# EAGLE design Led ControllerV2 (EAGLE 9.4.2)
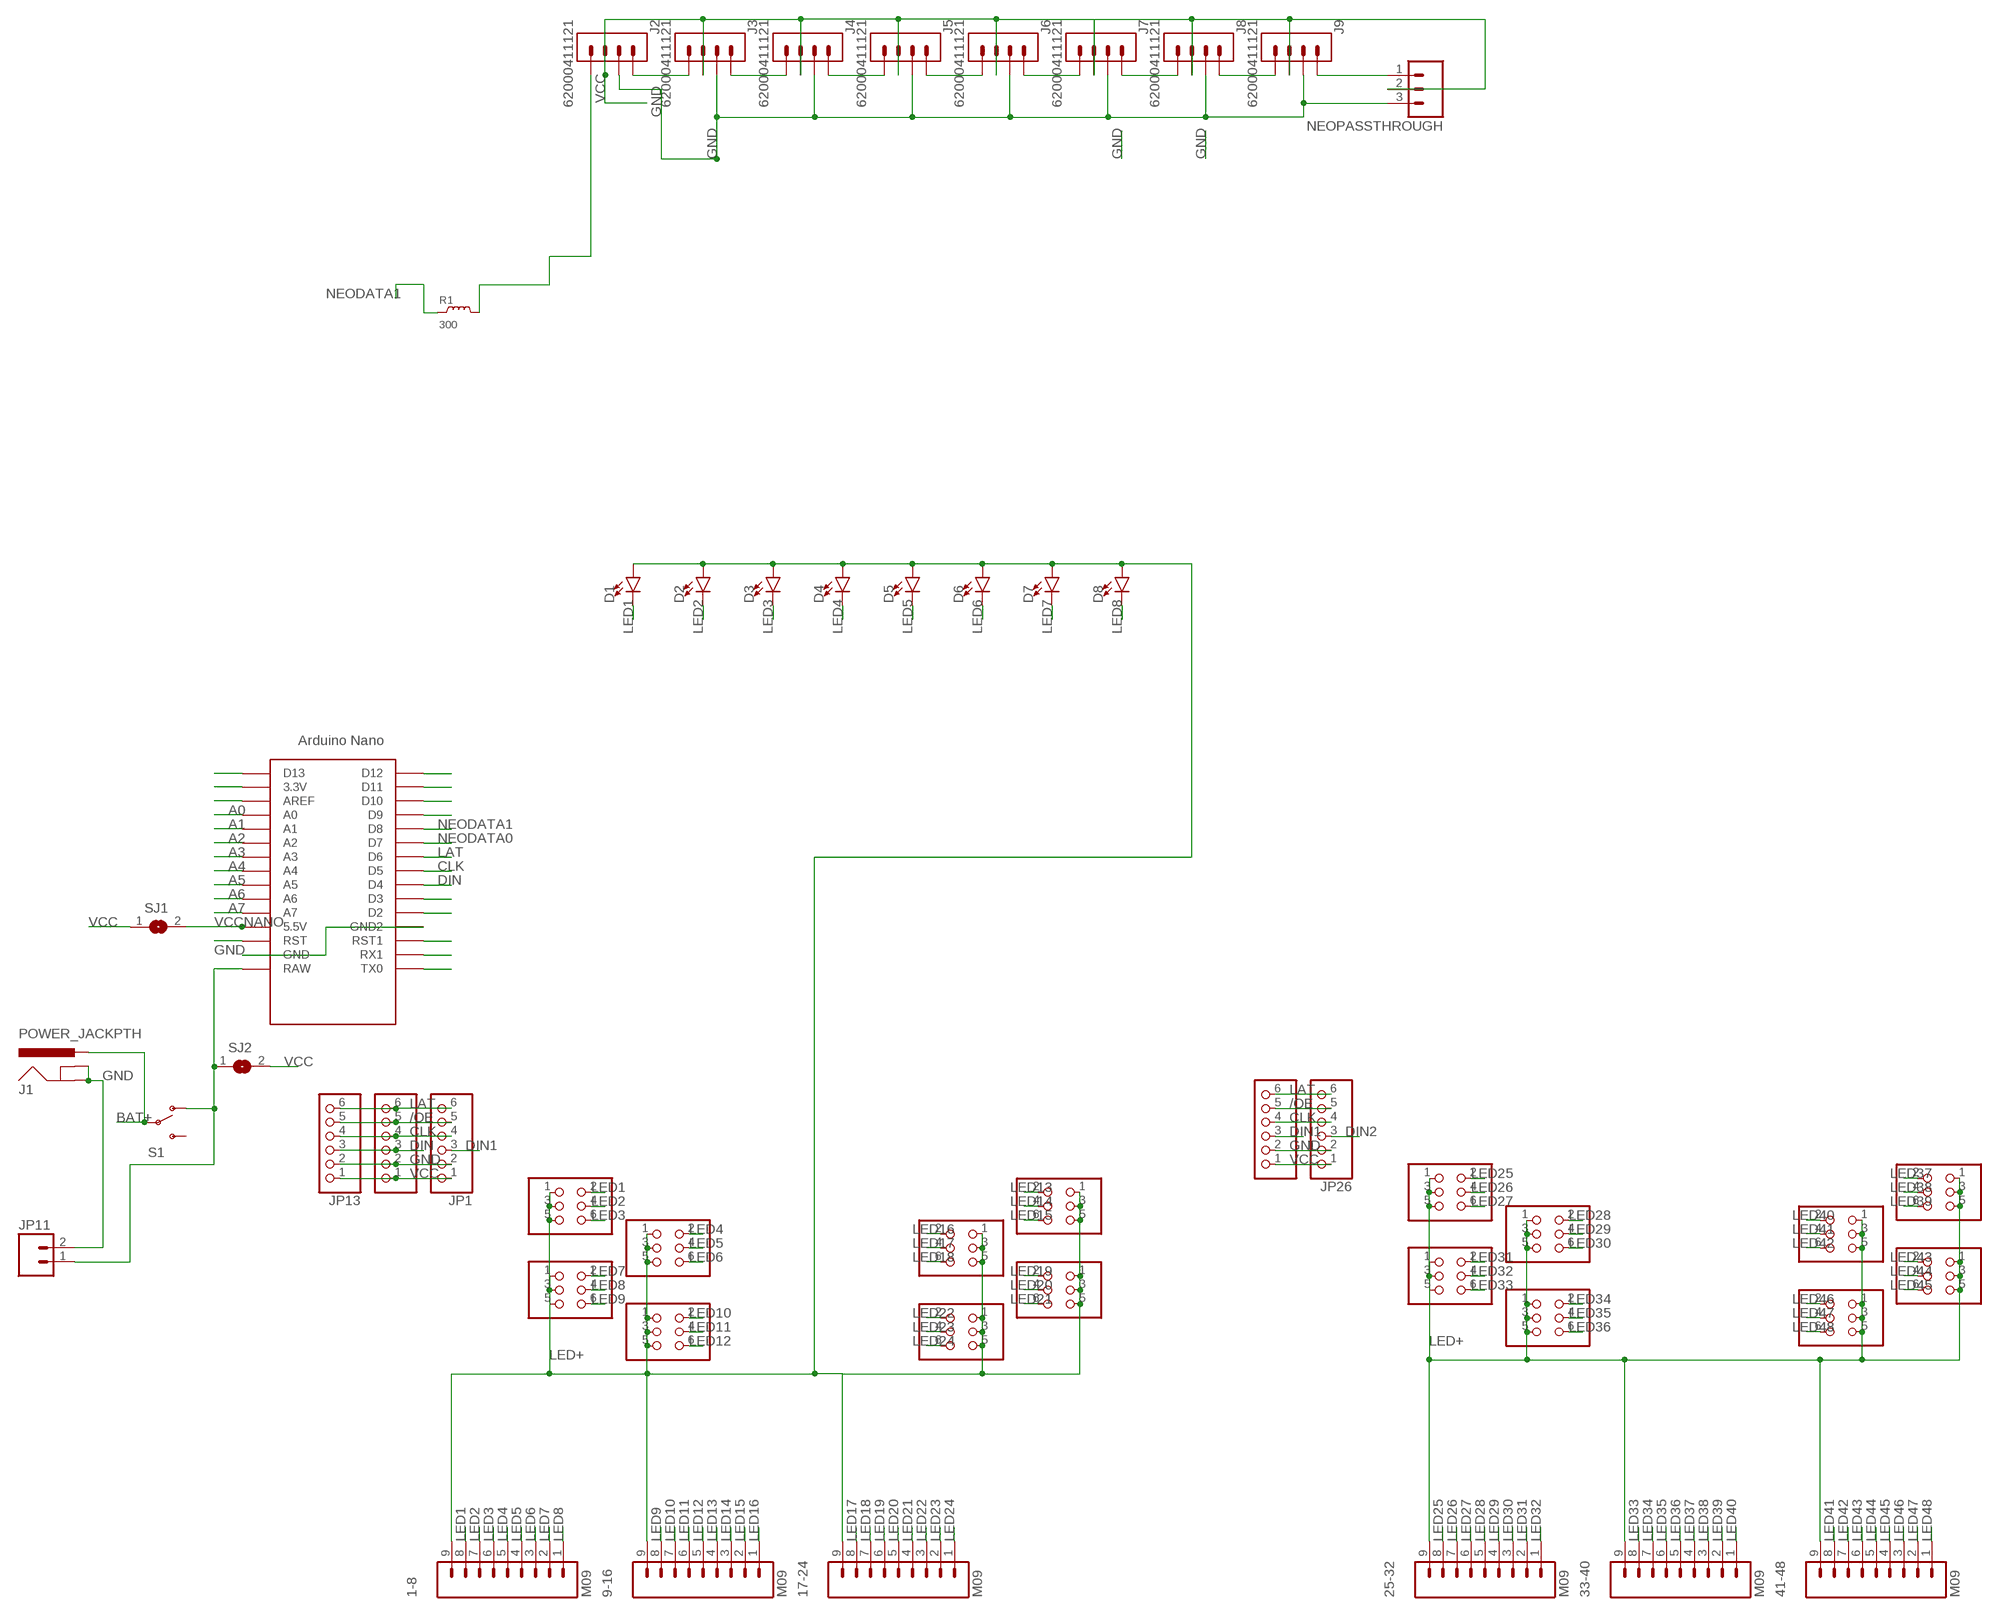
[diagram p0: schematic, sheet 1, part 1 of 2]
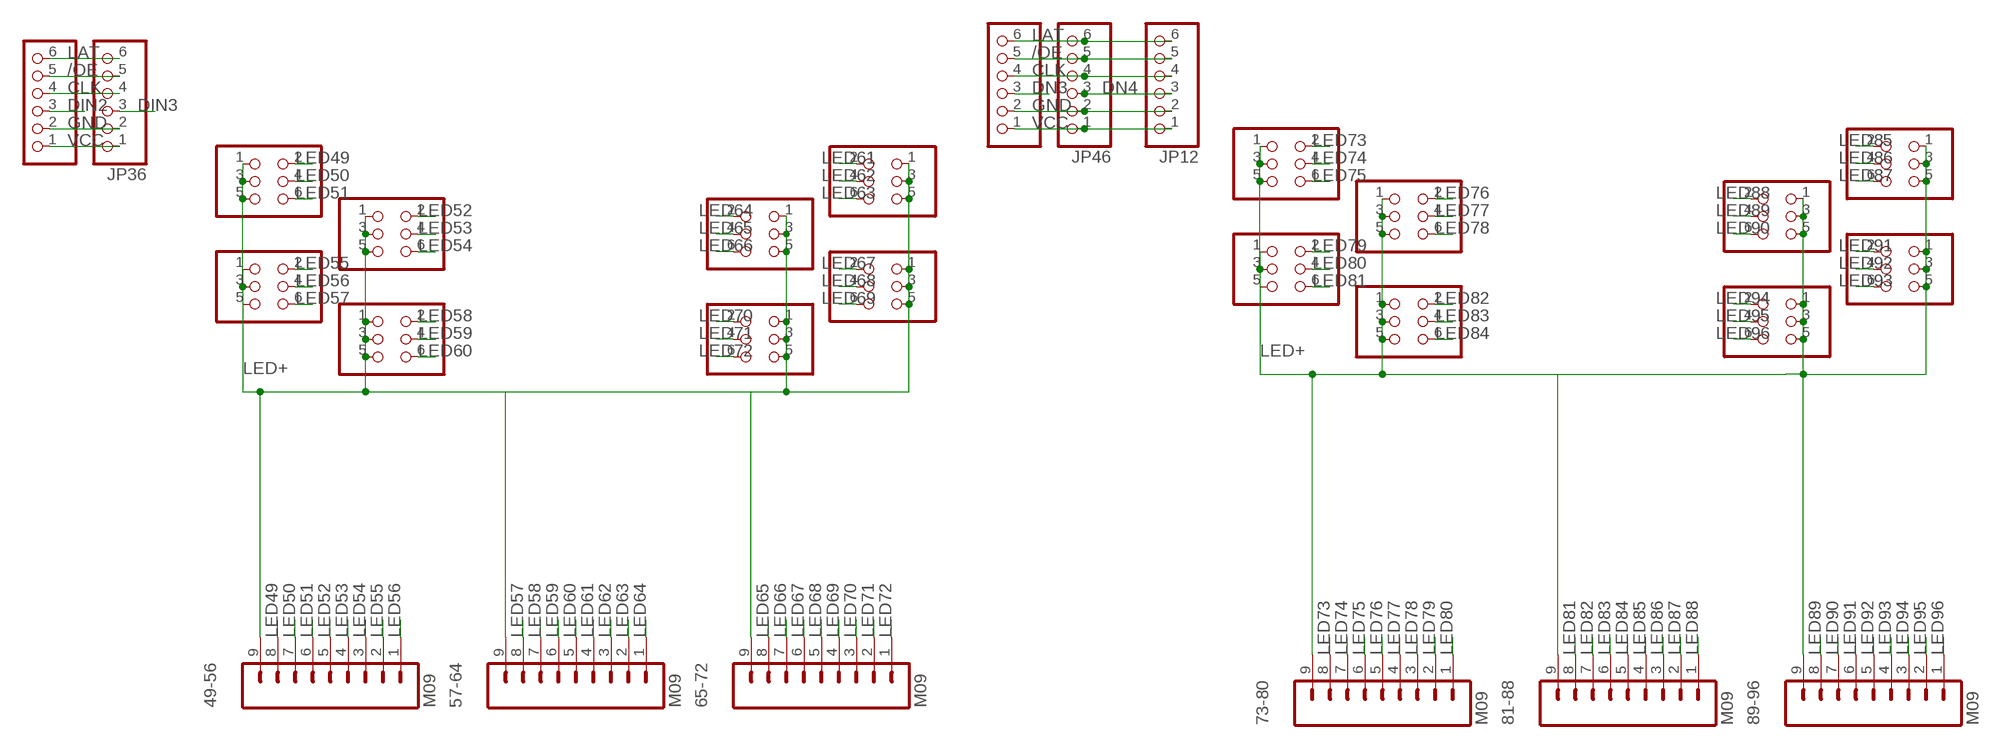
[diagram p1: schematic, sheet 1, part 2 of 2]

## Parts
1-8  M09  [1X09]
9-16  M09  [1X09]
17-24  M09  [1X09]
25-32  M09  [1X09]
33-40  M09  [1X09]
41-48  M09  [1X09]
49-56  M09  [1X09]
57-64  M09  [1X09]
65-72  M09  [1X09]
73-80  M09  [1X09]
81-88  M09  [1X09]
89-96  M09  [1X09]
D1  LED5MM  [LED_5MM]
D2  LED5MM  [LED_5MM]
D3  LED5MM  [LED_5MM]
D4  LED5MM  [LED_5MM]
D5  LED5MM  [LED_5MM]
D6  LED5MM  [LED_5MM]
D7  LED5MM  [LED_5MM]
D8  LED5MM  [LED_5MM]
J1  POWER_JACKPTH  [POWER_JACK_PTH]
J2  62000411121  [62000411121]
J3  62000411121  [62000411121]
J4  62000411121  [62000411121]
J5  62000411121  [62000411121]
J6  62000411121  [62000411121]
J7  62000411121  [62000411121]
J8  62000411121  [62000411121]
J9  62000411121  [62000411121]
JP1  INPUT  PINHD-1X6CB  [1X06-CLEANBIG]
JP2  HEADER-2X3  [2X03_ROUND_70MIL]
JP3  HEADER-2X3  [2X03_ROUND_70MIL]
JP4  HEADER-2X3  [2X03_ROUND_70MIL]
JP5  HEADER-2X3  [2X03_ROUND_70MIL]
JP6  HEADER-2X3  [2X03_ROUND_70MIL]
JP7  HEADER-2X3  [2X03_ROUND_70MIL]
JP8  HEADER-2X3  [2X03_ROUND_70MIL]
JP9  HEADER-2X3  [2X03_ROUND_70MIL]
JP10  OUTPUT  PINHD-1X6CB  [1X06-CLEANBIG]
JP11  M02POLAR  [MOLEX-1X2]
JP12  INPUT  PINHD-1X6CB  [1X06-CLEANBIG]
JP13  INPUT  PINHD-1X6CB  [1X06-CLEANBIG]
JP22  HEADER-2X3  [2X03_ROUND_70MIL]
JP23  HEADER-2X3  [2X03_ROUND_70MIL]
JP24  HEADER-2X3  [2X03_ROUND_70MIL]
JP25  HEADER-2X3  [2X03_ROUND_70MIL]
JP26  INPUT  PINHD-1X6CB  [1X06-CLEANBIG]
JP27  OUTPUT  PINHD-1X6CB  [1X06-CLEANBIG]
JP28  HEADER-2X3  [2X03_ROUND_70MIL]
JP29  HEADER-2X3  [2X03_ROUND_70MIL]
JP30  HEADER-2X3  [2X03_ROUND_70MIL]
JP31  HEADER-2X3  [2X03_ROUND_70MIL]
JP32  HEADER-2X3  [2X03_ROUND_70MIL]
JP33  HEADER-2X3  [2X03_ROUND_70MIL]
JP34  HEADER-2X3  [2X03_ROUND_70MIL]
JP35  HEADER-2X3  [2X03_ROUND_70MIL]
JP36  INPUT  PINHD-1X6CB  [1X06-CLEANBIG]
JP37  OUTPUT  PINHD-1X6CB  [1X06-CLEANBIG]
JP38  HEADER-2X3  [2X03_ROUND_70MIL]
JP39  HEADER-2X3  [2X03_ROUND_70MIL]
JP40  HEADER-2X3  [2X03_ROUND_70MIL]
JP41  HEADER-2X3  [2X03_ROUND_70MIL]
JP42  HEADER-2X3  [2X03_ROUND_70MIL]
JP43  HEADER-2X3  [2X03_ROUND_70MIL]
JP44  HEADER-2X3  [2X03_ROUND_70MIL]
JP45  HEADER-2X3  [2X03_ROUND_70MIL]
JP46  INPUT  PINHD-1X6CB  [1X06-CLEANBIG]
JP47  OUTPUT  PINHD-1X6CB  [1X06-CLEANBIG]
JP48  HEADER-2X3  [2X03_ROUND_70MIL]
JP49  HEADER-2X3  [2X03_ROUND_70MIL]
JP50  HEADER-2X3  [2X03_ROUND_70MIL]
JP51  HEADER-2X3  [2X03_ROUND_70MIL]
NEOPASSTHROUGH  M03PTH  [1X03]
R1  300  COIL-AXL-REGULAR  [AXL-REGULAR]
S1  SWITCH-SPSTPTH  [SWITCH-SPDT]
SJ1  JUMPER  [SJW]
SJ2  JUMPER  [SJW]
U$1  NANO  [NANO]

## Nets
/OE: JP1.5 JP10.5 JP12.5 JP13.5 JP26.5 JP27.5 JP36.5 JP37.5 JP46.5 JP47.5
A0: U$1.A0
A1: U$1.A1
A2: U$1.A2
A3: U$1.A3
A4: U$1.A4
A5: U$1.A5
A6: U$1.A6
A7: U$1.A7
BAT+: J1.PWR S1.2(P)
CLK: JP1.4 JP10.4 JP12.4 JP13.4 JP26.4 JP27.4 JP36.4 JP37.4 JP46.4 JP47.4 U$1.D5
DATAIN: J2.4 R1.2
DIN: JP10.3 JP13.3 U$1.D4
DIN1: JP1.3 JP27.3
DIN2: JP26.3 JP37.3
DIN3: JP36.3
DN3: JP47.3
DN4: JP12.3 JP46.3
GND: J1.GND J1.GNDBREAK J2.2 J3.2 J4.2 J5.2 J6.2 J7.2 J8.2 J9.2 JP1.2 JP10.2 JP11.2 JP12.2 JP13.2 JP26.2 JP27.2 JP36.2 JP37.2 JP46.2 JP47.2 NEOPASSTHROUGH.3 U$1.GND U$1.GND1(GND2)
LAT: JP1.6 JP10.6 JP12.6 JP13.6 JP26.6 JP27.6 JP36.6 JP37.6 JP46.6 JP47.6 U$1.D6
LED1: 1-8.8 D1.K(C) JP2.2
LED2: 1-8.7 D2.K(C) JP2.4
LED3: 1-8.6 D3.K(C) JP2.6
LED4: 1-8.5 D4.K(C) JP3.2
LED5: 1-8.4 D5.K(C) JP3.4
LED6: 1-8.3 D6.K(C) JP3.6
LED7: 1-8.2 D7.K(C) JP4.2
LED8: 1-8.1 D8.K(C) JP4.4
LED9: 9-16.8 JP4.6
LED10: 9-16.7 JP5.2
LED11: 9-16.6 JP5.4
LED12: 9-16.5 JP5.6
LED13: 9-16.4 JP6.2
LED14: 9-16.3 JP6.4
LED15: 9-16.2 JP6.6
LED16: 9-16.1 JP7.2
LED17: 17-24.8 JP7.4
LED18: 17-24.7 JP7.6
LED19: 17-24.6 JP8.2
LED20: 17-24.5 JP8.4
LED21: 17-24.4 JP8.6
LED22: 17-24.3 JP9.2
LED23: 17-24.2 JP9.4
LED24: 17-24.1 JP9.6
LED25: 25-32.8 JP22.2
LED26: 25-32.7 JP22.4
LED27: 25-32.6 JP22.6
LED28: 25-32.5 JP23.2
LED29: 25-32.4 JP23.4
LED30: 25-32.3 JP23.6
LED31: 25-32.2 JP24.2
LED32: 25-32.1 JP24.4
LED33: 33-40.8 JP24.6
LED34: 33-40.7 JP25.2
LED35: 33-40.6 JP25.4
LED36: 33-40.5 JP25.6
LED37: 33-40.4 JP28.2
LED38: 33-40.3 JP28.4
LED39: 33-40.2 JP28.6
LED40: 33-40.1 JP29.2
LED41: 41-48.8 JP29.4
LED42: 41-48.7 JP29.6
LED43: 41-48.6 JP30.2
LED44: 41-48.5 JP30.4
LED45: 41-48.4 JP30.6
LED46: 41-48.3 JP31.2
LED47: 41-48.2 JP31.4
LED48: 41-48.1 JP31.6
LED49: 49-56.8 JP32.2
LED50: 49-56.7 JP32.4
LED51: 49-56.6 JP32.6
LED52: 49-56.5 JP33.2
LED53: 49-56.4 JP33.4
LED54: 49-56.3 JP33.6
LED55: 49-56.2 JP34.2
LED56: 49-56.1 JP34.4
LED57: 57-64.8 JP34.6
LED58: 57-64.7 JP35.2
LED59: 57-64.6 JP35.4
LED60: 57-64.5 JP35.6
LED61: 57-64.4 JP38.2
LED62: 57-64.3 JP38.4
LED63: 57-64.2 JP38.6
LED64: 57-64.1 JP39.2
LED65: 65-72.8 JP39.4
LED66: 65-72.7 JP39.6
LED67: 65-72.6 JP40.2
LED68: 65-72.5 JP40.4
LED69: 65-72.4 JP40.6
LED70: 65-72.3 JP41.2
LED71: 65-72.2 JP41.4
LED72: 65-72.1 JP41.6
LED73: 73-80.8 JP42.2
LED74: 73-80.7 JP42.4
LED75: 73-80.6 JP42.6
LED76: 73-80.5 JP43.2
LED77: 73-80.4 JP43.4
LED78: 73-80.3 JP43.6
LED79: 73-80.2 JP44.2
LED80: 73-80.1 JP44.4
LED81: 81-88.8 JP44.6
LED82: 81-88.7 JP45.2
LED83: 81-88.6 JP45.4
LED84: 81-88.5 JP45.6
LED85: 81-88.4 JP48.2
LED86: 81-88.3 JP48.4
LED87: 81-88.2 JP48.6
LED88: 81-88.1 JP49.2
LED89: 89-96.8 JP49.4
LED90: 89-96.7 JP49.6
LED91: 89-96.6 JP50.2
LED92: 89-96.5 JP50.4
LED93: 89-96.4 JP50.6
LED94: 89-96.3 JP51.2
LED95: 89-96.2 JP51.4
LED96: 89-96.1 JP51.6
LED+: 1-8.9 9-16.9 17-24.9 25-32.9 33-40.9 41-48.9 49-56.9 57-64.9 65-72.9 73-80.9 81-88.9 89-96.9 D1.A D2.A D3.A D4.A D5.A D6.A D7.A D8.A JP2.1 JP2.3 JP2.5 JP3.1 JP3.3 JP3.5 JP4.1 JP4.3 JP4.5 JP5.1 JP5.3 JP5.5 JP6.1 JP6.3 JP6.5 JP7.1 JP7.3 JP7.5 JP8.1 JP8.3 JP8.5 JP9.1 JP9.3 JP9.5 JP22.1 JP22.3 JP22.5 JP23.1 JP23.3 JP23.5 JP24.1 JP24.3 JP24.5 JP25.1 JP25.3 JP25.5 JP28.1 JP28.3 JP28.5 JP29.1 JP29.3 JP29.5 JP30.1 JP30.3 JP30.5 JP31.1 JP31.3 JP31.5 JP32.1 JP32.3 JP32.5 JP33.1 JP33.3 JP33.5 JP34.1 JP34.3 JP34.5 JP35.1 JP35.3 JP35.5 JP38.1 JP38.3 JP38.5 JP39.1 JP39.3 JP39.5 JP40.1 JP40.3 JP40.5 JP41.1 JP41.3 JP41.5 JP42.1 JP42.3 JP42.5 JP43.1 JP43.3 JP43.5 JP44.1 JP44.3 JP44.5 JP45.1 JP45.3 JP45.5 JP48.1 JP48.3 JP48.5 JP49.1 JP49.3 JP49.5 JP50.1 JP50.3 JP50.5 JP51.1 JP51.3 JP51.5
N$1: JP11.1 S1.1(O) SJ2.1 U$1.RAW
N$2: U$1.RST
N$4: J9.1 NEOPASSTHROUGH.1
N$11: U$1.AREF
N$12: U$1.3.3V
N$13: U$1.D13
N$14: U$1.D12
N$15: U$1.D11
N$16: U$1.D10
N$17: U$1.D9
N$23: U$1.D3
N$24: U$1.D2
N$25: U$1.RST1
N$26: U$1.RX1
N$27: U$1.TX0
N$30: J2.1 J3.4
N$31: J3.1 J4.4
N$32: J4.1 J5.4
N$34: J5.1 J6.4
N$35: J6.1 J7.4
N$36: J7.1 J8.4
N$37: J8.1 J9.4
NEODATA0: U$1.D7
NEODATA1: R1.1 U$1.D8
VCC: J2.3 J3.3 J4.3 J5.3 J6.3 J7.3 J8.3 J9.3 JP1.1 JP10.1 JP12.1 JP13.1 JP26.1 JP27.1 JP36.1 JP37.1 JP46.1 JP47.1 NEOPASSTHROUGH.2 SJ1.1 SJ2.2
VCCNANO: SJ1.2 U$1.5V(5.5V)
Unconnected: S1.3(S) U$1.ICSP1 U$1.ICSP2 U$1.ICSP3 U$1.ICSP4 U$1.ICSP5 U$1.ICSP6

## Library data of the parts
1-8 9-16 17-24 25-32 33-40 41-48 49-56 57-64 65-72 73-80 81-88 89-96 = SparkFun:M09: Header 9 Standard 9-pin 0.1" header. Use with straight break away headers (SKU : PRT-00116), right angle break away headers (PRT-00553), swiss pins (PRT-00743), machine pins (PRT-00117), and female headers (PRT-00115).
D1-D8 = SparkFun-LED:LED: LED (Generic) Standard schematic elements and footprints for 5mm, 3mm, 1206, and 0603 sized LEDs. Generic LEDs with no color specified.
J1 = SparkFun:POWER_JACK: Power Jack This is the standard 5.5mm barrel jack for power. The PTH is the most common, proven, reliable, footprint. All others are experimental. The Slot footprint only works if the mill layer is transmitted to the PCB fab house so be warned. Spark Fun Electronics SKU : PRT-00119. Mating wall wart : TOL-00298 (and others); MPN: RAPC712BK; OC_NEWARK: 03M4244
J2-J9 = Headers:62000411121: THT Vertical Pin Header WR-PHD, Pitch 2.00 mm, Single Row, 4 pins Manufacturer's datasheet <https://datasheet.octopart.com/62000411121-W%C3%BCrth-Elektronik-datasheet-117282003.pdf>; CREATED_BY: PCBLayout.com; MANUFACTURER: Würth Elektronik; OC_NEWARK: unknown
JP1 JP10 JP12 JP13 JP26 JP27 JP36 JP37 JP46 JP47 = adafruit:PINHD-1X6: PIN HEADER; MPN: 1016; OC_NEWARK: 31Y5676
JP2-JP9 JP22-JP25 JP28-JP35 JP38-JP45 JP48-JP51 = microbuilder:HEADER-2X3: PIN HEADER; OC_NEWARK: unknown
JP11 = SparkFun:M02: Header 2 Standard 2-pin 0.1" header. Use with straight break away headers (SKU : PRT-00116), right angle break away headers (PRT-00553), swiss pins (PRT-00743), machine pins (PRT-00117), and female headers (PRT-00115). Molex polarized connector foot print use with SKU : PRT-08233 with associated crimp pins and housings.; MPN: 171856-0002; OC_NEWARK: 06X9806
NEOPASSTHROUGH = SparkFun:M03: Header 3 Standard 3-pin 0.1" header. Use with straight break away headers (SKU : PRT-00116), right angle break away headers (PRT-00553), swiss pins (PRT-00743), machine pins (PRT-00117), and female headers (PRT-00115). Molex polarized connector foot print use with SKU : PRT-08232 with associated crimp pins and housings.
R1 = FaBo-Coil:COIL: RESISTOR
S1 = SparkFun:SWITCH-SPST: SPST Switch Simple slide switch. Spark Fun Electronics SKU : COM-00102; MPN: 1825232-1; OC_NEWARK: 97X7939
SJ1 SJ2 = BaseApp:JUMPER
U$1 = Arduino-clone:NANO: Arduino Nano; OC_NEWARK: unknown

## Net classes
0 everything: width 0.254 mm

## Board
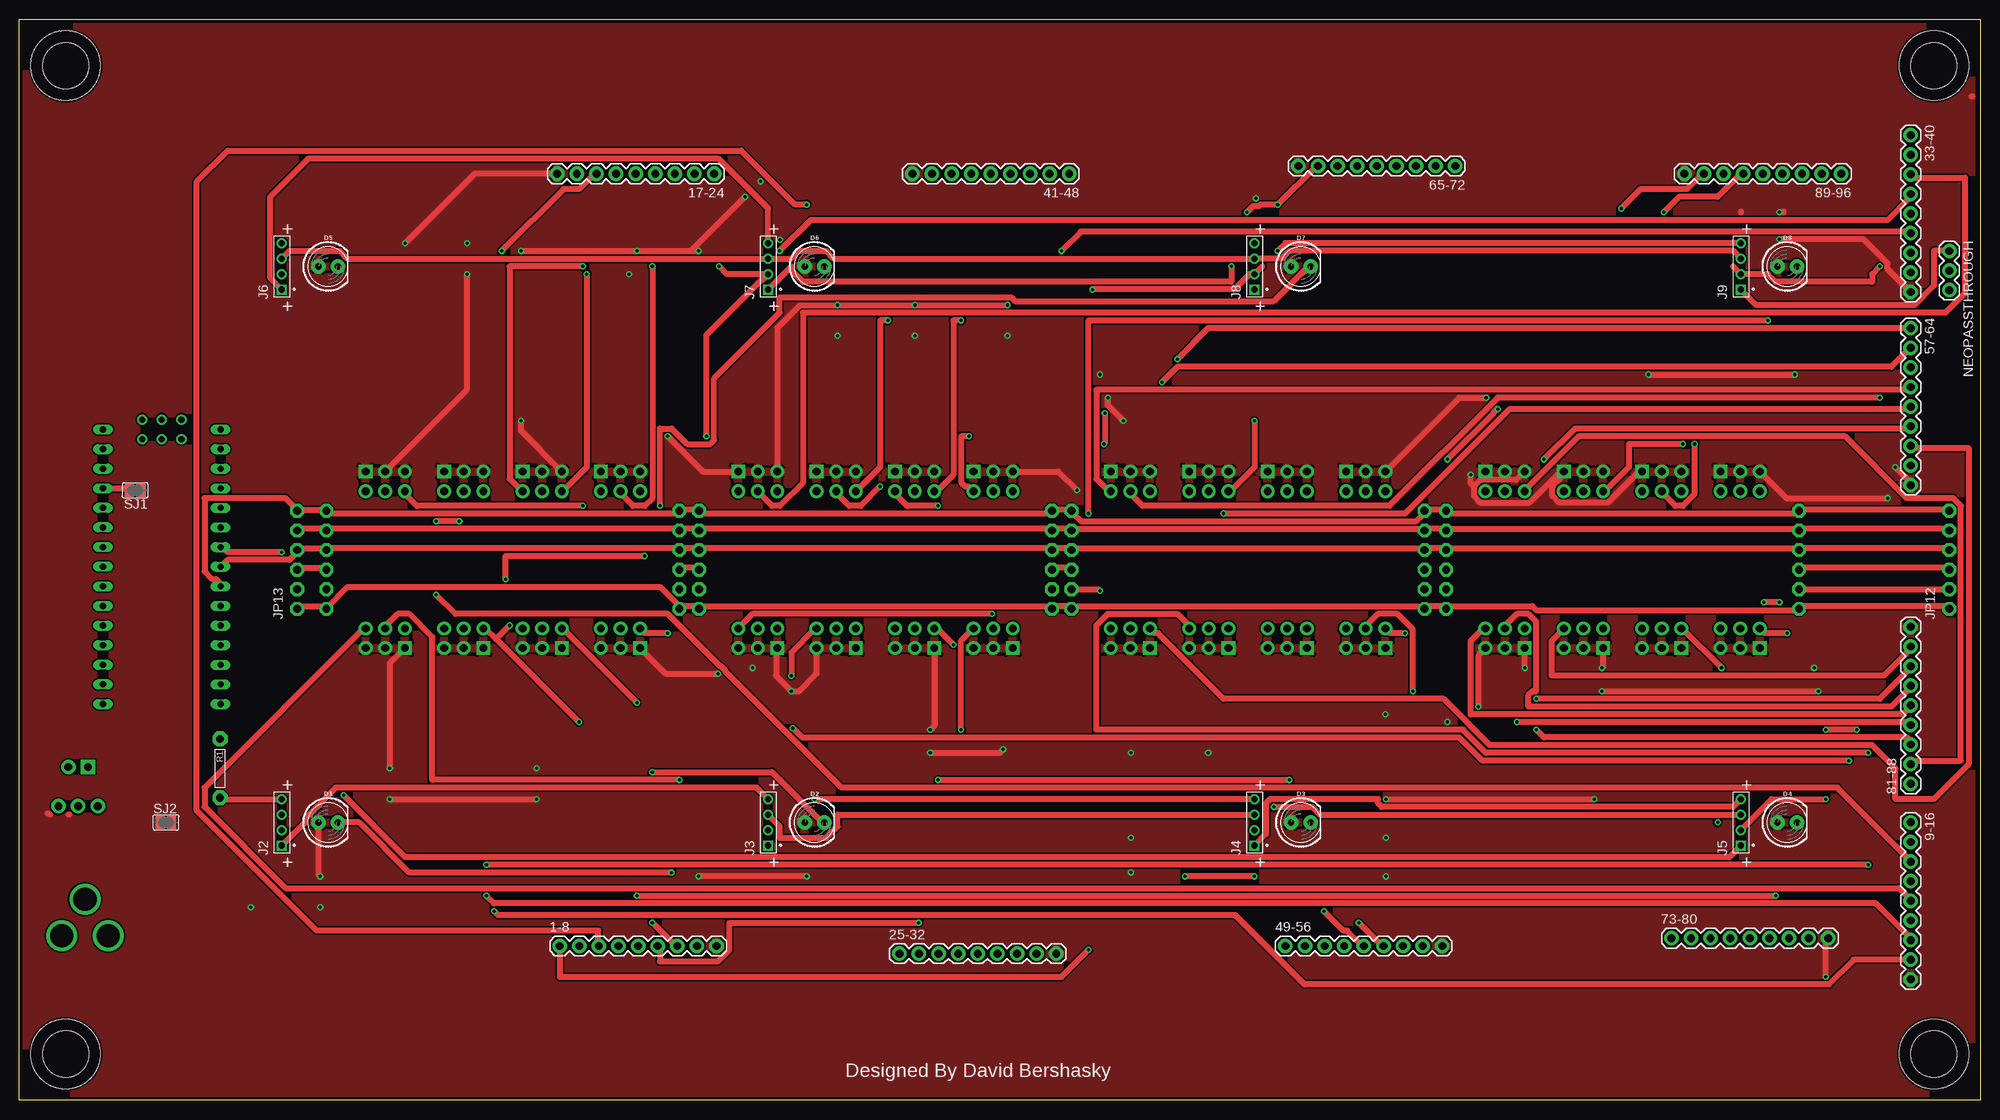
[diagram p2: board, top side]
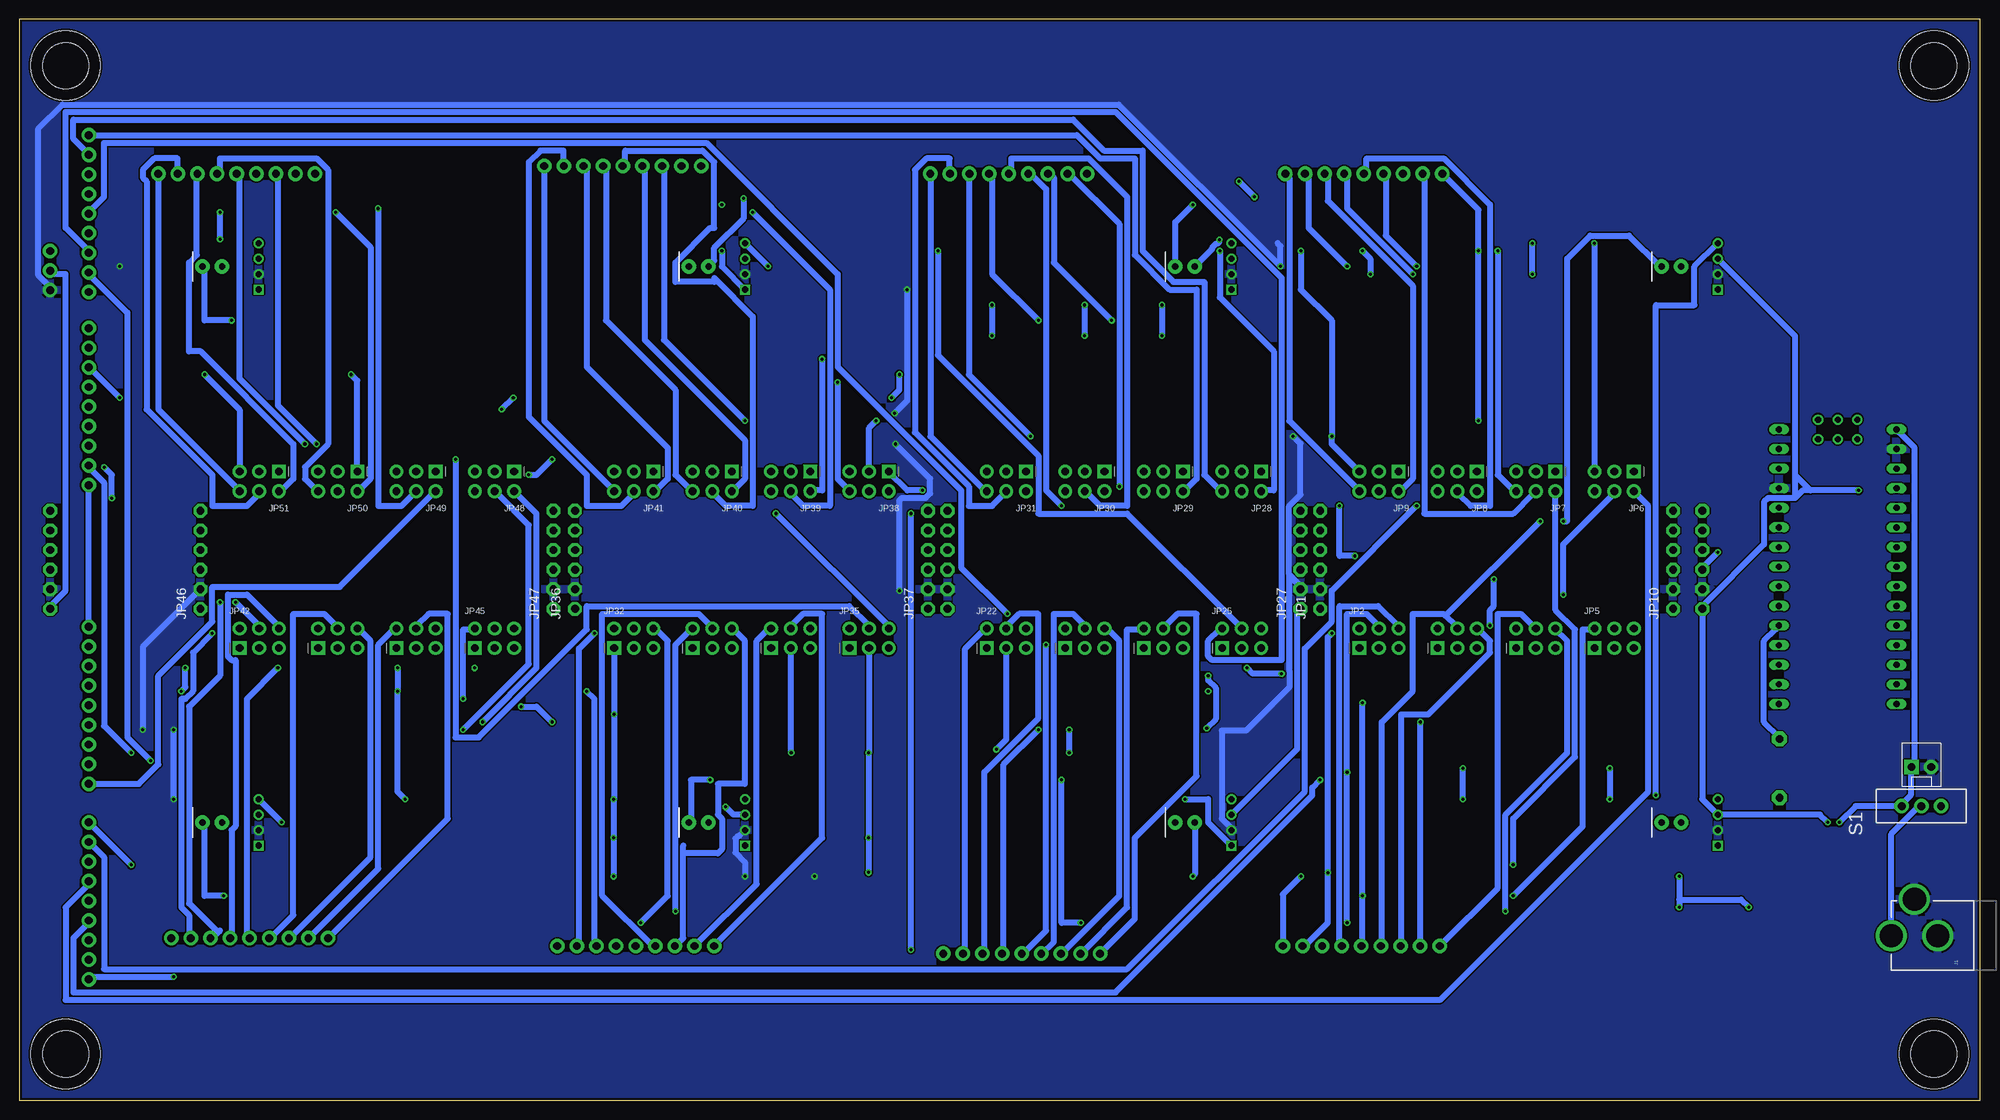
[diagram p3: board, bottom side, seen from below]

Size 254 x 140 mm. Coordinates in mm from the lower left corner, seen from the top.
Outline: 0,0 0,140 254,140 254,0 0,0
Copper layers (1*16): Top 0.035mm / dielectric 1.5mm / Bottom 0.035mm
Design rules "adafruit *": minimum track width 30mil, minimum drill 15.5mil, track to track 8mil, track to pad 8mil, pad to pad 8mil, via to via 8mil, smd to smd 8mil, copper to edge 10mil, drill to drill 8mil, minimum pad ring 10mil, minimum via ring 8mil, stop-mask expansion 4mil, vias tented up to drill 20mil, thermal gap 10mil
Holes 6 mm at 6,134 248,134 6,6 248,6
Holes 9 mm at 6,6 248,6 248,134 6,134

### Footprints (pad centres in the part's own frame; a part is rotated, then mirrored left to right if it is on the bottom)
1X09 = drill 1.016 pad 1.88: 1 0,0; 2 2.54,0; 3 5.08,0; 4 7.62,0; 5 10.16,0; 6 12.7,0; 7 15.24,0; 8 17.78,0; 9 20.32,0
LED_5MM = drill 0.813 pad 1.88: A -1.27,0; K 1.27,0
POWER_JACK_PTH = drill 2.997: GND 0,7.7; GNDBREAK 4.7,10.7; PWR 0,13.7
62000411121 = drill 0.8 square: 1 -3,0 | drill 0.8: 2 -1,0; 3 1,0; 4 3,0
1X06-CLEANBIG = drill 1.016 pad 1.778 octagon: 1 -6.35,0; 2 -3.81,0; 3 -1.27,0; 4 1.27,0; 5 3.81,0; 6 6.35,0
2X03_ROUND_70MIL = drill 1 pad 1.778 square: 1 -2.54,-1.27 | drill 1 pad 1.778: 2 -2.54,1.27; 3 0,-1.27; 4 0,1.27; 5 2.54,-1.27; 6 2.54,1.27
MOLEX-1X2 = drill 1.016 pad 1.88 square: 1 0,0 | drill 1.016 pad 1.88: 2 2.54,0
1X03 = drill 1.016 pad 1.88: 1 0,0; 2 2.54,0; 3 5.08,0
AXL-REGULAR = drill 1 pad 1.93 octagon: 1 -3.81,0; 2 3.81,0
SWITCH-SPDT = drill 1.016 pad 1.88: 1 0,2.54; 2 0,0; 3 0,-2.54
SJW = smd 1.168 x 1.6: 1 -0.762,0; 2 0.762,0
NANO = drill 0.8 long: 3.3V -10.16,24.13; 5V -10.16,-1.27; A0 -10.16,19.05; A1 -10.16,16.51; A2 -10.16,13.97; A3 -10.16,11.43; A4 -10.16,8.89; A5 -10.16,6.35; A6 -10.16,3.81; A7 -10.16,1.27; AREF -10.16,21.59; D2 5.08,1.27; D3 5.08,3.81; D4 5.08,6.35; D5 5.08,8.89; D6 5.08,11.43; D7 5.08,13.97; D8 5.08,16.51; D9 5.08,19.05; D10 5.08,21.59; D11 5.08,24.13; D12 5.08,26.67; D13 -10.16,26.67; GND -10.16,-6.35; GND1 5.08,-1.27; RAW -10.16,-8.89; RST -10.16,-3.81; RST1 5.08,-3.81; RX1 5.08,-6.35; TX0 5.08,-8.89 | drill 0.8: ICSP1 -5.08,-10.16; ICSP2 -5.08,-7.62; ICSP3 -2.54,-10.16; ICSP4 -2.54,-7.62; ICSP5 0,-10.16; ICSP6 0,-7.62

### Placement (x,y rotation side)
1-8  70,20 0 top
9-16  245,36 270 top
17-24  90,120 180 top
25-32  114,19 0 top
33-40  245,125 270 top
41-48  136,120 180 top
49-56  164,20 0 top
57-64  245,100 270 top
65-72  186,121 180 top
73-80  214,21 0 top
81-88  245,41 90 top
89-96  236,120 180 top
D1  40,36 0 top
D2  103,36 0 top
D3  166,36 0 top
D4  229,36 0 top
D5  40,108 0 top
D6  103,108 0 top
D7  166,108 0 top
D8  229,108 0 top
J1  -2.19,21.33 90 bottom
J2  34,36 90 top
J3  97,36 90 top
J4  160,36 90 top
J5  223,36 90 top
J6  34,108 90 top
J7  97,108 90 top
J8  160,108 90 top
J9  223,108 90 top
JP1  85.5,70 90 bottom
JP2  77.88,59.84 0 bottom
JP3  67.72,59.84 0 bottom
JP4  57.56,59.84 0 bottom
JP5  47.4,59.84 0 bottom
JP6  47.4,80.16 180 bottom
JP7  57.56,80.16 180 bottom
JP8  67.72,80.16 180 bottom
JP9  77.88,80.16 180 bottom
JP10  39.78,70 90 bottom
JP11  8.89,43.18 0 bottom
JP12  250,70 90 top
JP13  36,70 90 top
JP22  126.14,59.84 0 bottom
JP23  115.98,59.84 0 bottom
JP24  105.82,59.84 0 bottom
JP25  95.66,59.84 0 bottom
JP26  133.76,70 90 bottom
JP27  88.04,70 90 bottom
JP28  95.66,80.16 180 bottom
JP29  105.82,80.16 180 bottom
JP30  115.98,80.16 180 bottom
JP31  126.14,80.16 180 bottom
JP32  174.4,59.84 0 bottom
JP33  164.24,59.84 0 bottom
JP34  154.08,59.84 0 bottom
JP35  143.92,59.84 0 bottom
JP36  182.02,70 90 bottom
JP37  136.3,70 90 bottom
JP38  143.92,80.16 180 bottom
JP39  154.08,80.16 180 bottom
JP40  164.24,80.16 180 bottom
JP41  174.4,80.16 180 bottom
JP42  222.92,59.84 0 bottom
JP43  212.76,59.84 0 bottom
JP44  202.6,59.84 0 bottom
JP45  192.44,59.84 0 bottom
JP46  230.54,70 90 bottom
JP47  184.82,70 90 bottom
JP48  192.44,80.16 180 bottom
JP49  202.6,80.16 180 bottom
JP50  212.76,80.16 180 bottom
JP51  222.92,80.16 180 bottom
NEOPASSTHROUGH  250,110 270 top
R1  26,43 270 top
S1  7.62,38.1 90 bottom
SJ1  15,79 180 top
SJ2  19,36 0 top
U$1  21,78 180 bottom

### Tracks (layer width: path | path; a pad name or v marks a point on that pad's centre or on a via)
/OE
  Top 0.762: JP12.5 250,74 231,74 JP46.5 230.5,74 185,74 JP47.5 184.5,74 182.5,74 JP36.5 182,74 136.5,74 JP37.5 136,74 134,74 JP26.5 133.5,74 88.5,74 JP27.5 88,74 86,74 JP1.5 85.5,74 40,74 JP10.5 39.5,74 36,74 JP13.5
BAT+
  Bottom 0.762: S1.2 8,38 11.5,34.5 11.5,21.5 J1.PWR
CLK
  Top 0.762: JP12.4 250,71.5 231,71.5 JP46.4 230.5,71.5 185,71.5 JP47.4 184.5,71.5 182.5,71.5 JP36.4 182,71.5 136.5,71.5 JP37.4 136,71.5 134,71.5 JP26.4 133.5,71.5 88.5,71.5 JP27.4 88,71.5 86,71.5 JP1.4 85.5,71.5 40,71.5 JP10.4 39.5,71.5 36,71.5 JP13.4 36,71 35,70 27,70 26.5,69.5 U$1.D5
DATAIN
  Top 0.762: J2.4 26,39 R1.2
DIN  (via drill 0.39)
  Top 0.762: v34,71 27,71 26.5,71.5 U$1.D4 | JP10.3 39.5,69 36,69 JP13.3
  Bottom 0.762: v34,71 36,69 JP13.3
DIN1
  Top 0.762: JP1.3 86,69 88,69 JP27.3
DIN2
  Top 0.762: JP26.3 134,69 136,69 JP37.3
DN4
  Top 0.762: JP46.3 231,69 250,69 JP12.3
GND  (via drill 0.39)
  Top 0.762: 222,108 J9.2 226.5,107 227.5,106 240,106 240,107 v241,108 | 161,108 J8.2 159.37,107 157.4,105.03 139.03,105.03 v139,105 | v90.62,108.02 91.64,107 J7.2 96.24,106.24 96.1,106.24 89,99.13 v89,86 | v160,29 v151,29 | JP46.2 JP12.2 | v238,48 v234,48 | J5.2 227,39 v234,39 | v140.61,89 140.61,85.12 v140.48,85 | JP37.2 139.81,66.19 v140,66
  Bottom 0.762: 91,111 90.62,110.62 v90.62,108.02 90.65,108.02 111.6,128.97 248.4,128.97 251.52,125.84 251.52,106.83 250,105.31 NEOPASSTHROUGH.3 | v89,86 88.04,85.04 88.04,78.43 89.52,76.96 89.52,68.12 88.04,66.65 JP27.2 88.04,66.51 89.53,68 89.53,55.7 89.5,55.67 89.5,53.5 95.1,47.9 98.24,47.9 98.24,36.49 97,35.25 J3.2 | J4.2 160.76,34.24 160.9,34.24 161.24,33.9 161.24,32.1 160,30.87 v160,29 | JP46.2 238,58.73 v238,48 | v234,39 v234,48 | v139,105 139,90.61 v140.61,89 | v140,66 140,77.69 139.68,78.02 136.59,78.02 136.02,78.59 136.02,80.53 v140.48,85
  pour Bottom: 0,139.7 254,139.7 254,0 0,0
LAT
  Top 0.762: JP12.6 250,76.5 231,76.5 JP46.6 230.5,76 185,76 JP47.6 184.5,76.5 182.5,76.5 JP36.6 182,76 181,75 137.5,75 136.5,76 JP37.6 136,76.5 134,76.5 JP26.6 133.5,76 88.5,76 JP27.6 88,76.5 86,76.5 JP1.6 85.5,76 40,76 JP10.6 39.5,76.5 36,76.5 | 36,76.5 34.5,78 24,78 24,68.5 25,67.5 25.5,67.5 26,67 U$1.D6 | 36,76.5 JP13.6
LED1  (via drill 0.39)
  Top 0.762: v84,60.5 81,60.5 80.5,61 JP2.2 | D1.K 44,36 50.5,29.5 v84.5,29.5
  Bottom 0.762: v84,60.5 84.5,60 v84.5,29.5 84.5,23 87.5,20 1-8.8
LED2  (via drill 0.39)
  Top 0.762: v82,23 85,20 1-8.7 | v82,42.5 97.5,42.5 104,36 D2.K
  Bottom 0.762: v82,23 v82,42.5 82,63 79.5,63 78,61.5 JP2.4
LED3  (via drill 0.39)
  Top 0.762: v119,41.5 v164.5,41.5 | v116.5,23 92,23 92,19.5 90.5,18 83,18 83,20 1-8.6
  Bottom 0.762: JP2.6 75.5,61.5 78,64 83,64 83,20 1-8.6 | v164.5,41.5 167,41.5 167,36 D3.K | v119,41.5 119,23 v116.5,23
LED4  (via drill 0.39)
  Top 0.762: v80,51.5 70.5,61 JP3.2 | v80,26.5 v227.5,26.5
  Bottom 0.762: v80,51.5 v80,26.5 80,20 1-8.5 | v227.5,26.5 230,26.5 230,36 D4.K
LED5  (via drill 0.39)
  Top 0.762: v57,75 v54,75
  Bottom 0.762: 69.25,62.75 69.5,63 73.5,63 73.5,53 77.5,49 77.5,20 1-8.4 | 69.25,62.75 68,61.5 JP3.4 | v54,75 53.5,75 53.5,109 50.5,112 45.5,112 41.5,108 D5.K | 69.25,62.75 v57,75
LED6  (via drill 0.39)
  Top 0.762: v102,116 100.5,116 93.5,123 27,123 23,119 23,37.5 38.5,22 75,22 75,20 1-8.3
  Bottom 0.762: JP3.6 65,61 63.5,59.5 63.5,58 71.5,50 75,50 75,20 1-8.3 | D6.K 104.27,113.73 v102,116
LED7  (via drill 0.39)
  Top 0.762: v72.5,49 61.75,59.75 | 61.75,59.75 60.5,61 JP4.2 | v83,77 83,87 84.5,87 86.5,85 89.5,85 90,85.5 90,93.5 98.5,102 98.5,104 128.5,104 129,103.5 162.5,103.5 167,108 D7.K | v81,70.5 63,70.5 v63,67.5 | 61.75,59.75 v63.5,61.5
  Bottom 0.762: v72.5,49 72.5,20 1-8.2 | v83,77 83,70.5 v81,70.5 | v63,67.5 63,64 63.5,63.5 v63.5,61.5
LED8  (via drill 0.39)
  Top 0.762: v226.5,101 138.5,101 v138.5,76 | v138.5,19.5 135,16 70,16 1-8.1
  Bottom 0.762: 1-8.1 62.5,27.5 62.5,63 59.5,63 58,61.5 JP4.4 | v226.5,101 230,101 230,108 D8.K | v138.5,19.5 v138.5,76
LED9  (via drill 0.39)
  Top 0.762: v61.5,24.5 62,24 157.5,24 166.48,15.02 234.41,15.02 237.61,18.22 9-16.8 245,18
  Bottom 0.762: v61.5,24.5 61.5,37 53.5,45 53.5,59.5 55,61 JP4.6
LED10  (via drill 0.39)
  Top 0.762: v60.5,26.5 61.5,25.5 240.5,25.5 245,21 9-16.7
  Bottom 0.762: v60.5,26.5 51.5,35.5 51.5,61 50,61 JP5.2
LED11  (via drill 0.39)
  Top 0.762: v85.5,41.5 53.5,41.5 53.5,60 50.5,63 49,63 47.5,61.5 JP5.4
  Bottom 0.762: v85.5,41.5 86.5,40.5 86.5,39.5 112,14 247,14 247,21 245,23 9-16.6
LED12
  Top 0.762: JP5.6 44.5,61 24,40.5 24,38 34.5,27.5 243.5,27.5 245,26 9-16.5
LED13
  Bottom 0.762: JP6.2 44.5,78.5 43,77 43,40 70,13 248,13 248,25 245,28 9-16.4
LED14  (via drill 0.39)
  Top 0.762: v54,65.5 56.5,63 84,63 90.76,56.24 90.89,56.24 91.47,55.67 91.47,55.53 106.5,40.5 235.5,40.5 245,31 9-16.3
  Bottom 0.762: v54,65.5 54,72 47.5,78.5 JP6.4
LED15  (via drill 0.39)
  Top 0.762: v73,77 51.5,77 50,78.5 JP6.6
  Bottom 0.762: v73,77 84,66 84,62 87.5,58.5 87.5,40 110.5,17 243,17 243,31.5 245,33.5 9-16.2
LED16  (via drill 0.39)
  Top 0.762: v239.5,30.5 v60.5,30.5
  Bottom 0.762: v60.5,30.5 60.5,36.5 52.5,44.5 52.5,61 55,63.5 55,78.5 JP7.2 | 9-16.1 v239.5,30.5
LED17
  Bottom 0.762: JP7.4 58,78.5 60.5,76 72,76 72,120 17-24.8
LED18  (via drill 0.39)
  Top 0.762: v62.5,110 70.5,118 72.5,118 74.5,120 17-24.7
  Bottom 0.762: v62.5,110 62.5,81 60.5,79 JP7.6
LED19  (via drill 0.39)
  Top 0.762: v73,108 63.5,108 63.5,80.5 65,79 JP8.2
  Bottom 0.762: v73,108 77,112 77,120 17-24.6
LED20
  Bottom 0.762: JP8.4 67.5,78.5 66,77 63.5,77 63.5,116 69.5,122 79.5,122 79.5,120 17-24.5
LED21  (via drill 0.39)
  Top 0.762: v73.5,107 73.5,82 70.5,79 JP8.6
  Bottom 0.762: v73.5,107 82,115.5 82,120 17-24.4
LED22
  Bottom 0.762: JP9.2 75,79 73.5,80.5 73.5,105.5 84.5,116.5 84.5,120 17-24.3
LED23  (via drill 0.39)
  Top 0.762: v82,108 82,78 81,77 79.5,77 78,78.5 JP9.4
  Bottom 0.762: v82,108 87,113 87,120 17-24.2
LED24
  Bottom 0.762: 17-24.1 89.5,119.5 89.5,88 80.5,79 JP9.6
LED25
  Bottom 0.762: JP22.2 129,61 131.5,58.5 131.5,19 25-32.8
LED26
  Bottom 0.762: JP22.4 126,61.5 124.5,63 122,63 122,49.5 129,42.5 129,19 25-32.7
LED27  (via drill 0.39)
  Top 0.762: v122,48 122,59.5 123.5,61 JP22.6
  Bottom 0.762: v122,48 126.5,43.5 126.5,19 25-32.6
LED28  (via drill 0.39)
  Top 0.762: v121,59 119,61 JP23.2
  Bottom 0.762: v121,59 121,22 124,19 25-32.5
LED29
  Bottom 0.762: JP23.4 116,61.5 117.5,63 120,63 120,20.5 121.5,19 25-32.4
LED30
  Bottom 0.762: JP23.6 113,61 111.5,59.5 111.5,26.5 119,19 25-32.3
LED31
  Bottom 0.762: JP24.2 108.5,61 110.5,61 110.5,25 116.5,19 25-32.2
LED32
  Bottom 0.762: 25-32.1 109.5,23.5 109.5,34 101.5,42 101.5,63 104,63 105.5,61.5 JP24.4
LED33  (via drill 0.39)
  Top 0.762: v237,44 189.5,44 186.5,47 101.39,47 v100.2,48.2 | JP24.6 103,61 100,58 v100,55
  Bottom 0.762: v237,44 240,47 240,102 245,107 33-40.8 | v100,55 100,54.39 99.02,53.41 99.02,49.38 v100.2,48.2
LED34
  Bottom 0.762: JP25.2 98.5,61 100,59.5 100,57.5 99.5,57 90.5,57 90.5,106.5 112,128 248,128 248,113 245,110 33-40.7
LED35  (via drill 0.39)
  Top 0.762: v135,110 137.5,112.5 245,112.5 33-40.6
  Bottom 0.762: v135,110 135,96.5 122,83.5 122,76 110.5,76 96,61.5 JP25.4
LED36  (via drill 0.39)
  Top 0.762: v126,63 95,63 93.5,61.5 JP25.6
  Bottom 0.762: v126,63 132,69 132,79 148,95 148,107 165,124 243,124 243,117 245,115 33-40.5
LED37  (via drill 0.39)
  Top 0.762: v98.5,110 102.5,114 242,114 245,117 33-40.4
  Bottom 0.762: v98.5,110 98.5,104 91.5,97 91.5,79 93,79 JP28.2
LED38
  Top 0.762: JP28.4 96,78.5 97.5,77 98.5,77 101.5,80 101.5,102 249.5,102 252,104.5 252,119.5 245,119.5 33-40.3
LED39
  Bottom 0.762: JP28.6 98.5,79 100.5,81 100.5,106 104.5,106 108.5,110 108.5,123 113.5,123 117.5,127 247,127 247,124.5 245,122.5 33-40.2
LED40
  Bottom 0.762: 33-40.1 117,125 114,122 109.5,122 109.5,109.5 105,105 101.5,105 101.5,80.5 103,79 JP29.2
LED41  (via drill 0.39)
  Top 0.762: v111.5,79.5 109,77 107.5,77 106,78.5 JP29.4
  Bottom 0.762: v111.5,79.5 111.5,113.5 118,120 41-48.8
LED42  (via drill 0.39)
  Top 0.762: v112.5,101 111.5,101 111.5,82 108.5,79 JP29.6
  Bottom 0.762: v112.5,101 120,108.5 120,119.5 120.5,120 41-48.7
LED43  (via drill 0.39)
  Top 0.762: v119,77 115,77 113.5,78.5 JP30.2
  Bottom 0.762: v119,77 121,79 121,118 123,120 41-48.6
LED44
  Bottom 0.762: JP30.4 115.5,78.5 114,77 110.5,77 110.5,117 115.5,122 125.5,122 125.5,120 41-48.5
LED45  (via drill 0.39)
  Top 0.762: v122,101 121,101 121,81 119,79 JP30.6
  Bottom 0.762: v122,101 128,107 128,120 41-48.4
LED46  (via drill 0.39)
  Top 0.762: v123,86 122,86 122,80 122.5,79.5 123,79.5 123.5,79 JP31.2
  Bottom 0.762: v123,86 131,94 131,120 41-48.3
LED47
  Bottom 0.762: JP31.4 126.5,78.5 128,77 131,77 131,79.5 138,86.5 138,120.5 136.5,122 133.5,122 133.5,120 41-48.2
LED48
  Bottom 0.762: 41-48.1 136,86 129,79 JP31.6
LED49  (via drill 0.39)
  Top 0.762: v179.5,60.5 177.5,60.5 177,61 JP32.2
  Bottom 0.762: v179.5,60.5 181.5,58.5 181.5,20 49-56.8
LED50  (via drill 0.39)
  Top 0.762: v180.5,53 180.5,61 178.5,63 176,63 174.5,61.5 JP32.4
  Bottom 0.762: v180.5,53 179.5,52 179.5,20 49-56.7
LED51  (via drill 0.39)
  Top 0.762: v173.5,23 176.5,20 49-56.6
  Bottom 0.762: v173.5,23 170,26.5 170,59.5 171.5,61 JP32.6
LED52  (via drill 0.39)
  Top 0.762: v169,24.5 171.5,22 172,22 174,20 49-56.5
  Bottom 0.762: v169,24.5 169,59 167,61 JP33.2
LED53
  Bottom 0.762: JP33.4 164.5,61.5 166,63 178.5,63 178.5,26.5 172,20 49-56.4
LED54
  Bottom 0.762: 168,32 168,21 169,20 49-56.3 | 168,32 168,33 | JP33.6 161.5,61 160,59.5 160,41 163.5,41 163.5,37 163,36.5 163,32.5 163.5,32 168,32
LED55
  Bottom 0.762: JP34.2 157,61 158.5,59.5 158.5,28 166.5,20 49-56.2
LED56
  Bottom 0.762: 49-56.1 150,34 150,63 152.5,63 154,61.5 JP34.4
LED57  (via drill 0.39)
  Top 0.762: v239.5,45 190,45 187,48 139.5,48 139.5,61.5 141,63 150,63 151.5,61.5 JP34.6
  Bottom 0.762: v239.5,45 243,48.5 243,80 245,82 57-64.8
LED58
  Top 0.762: JP35.2 146.5,61 147,60.5 147.5,60.5 156,52 184.5,52 190.5,46 240,46 243,43 243,39 248,39 252.5,43.5 252.5,84.5 245,84.5 57-64.7
LED59  (via drill 0.39)
  Top 0.762: v197.5,83 201.5,87 245,87 57-64.6
  Bottom 0.762: v197.5,83 197.5,47 194.5,47 180.5,61 180.5,64 146.5,64 144,61.5 JP35.4
LED60  (via drill 0.39)
  Top 0.762: v156,76 179.5,76 193,89.5 245,89.5 57-64.5
  Bottom 0.762: v156,76 141.5,61.5 JP35.6
LED61
  Top 0.762: JP38.2 141,79 139.5,80.5 139.5,92 245,92 57-64.4
LED62  (via drill 0.39)
  Top 0.762: v241,91 191.5,91 177.5,77 145.5,77 144,78.5 JP38.4
  Bottom 0.762: v241,91 245,95 57-64.3
LED63  (via drill 0.39)
  Top 0.762: v148,93 150,95 242.5,95 244.5,97 245,97 57-64.2
  Bottom 0.762: v148,93 148,80.5 146.5,79 JP38.6
LED64  (via drill 0.39)
  Top 0.762: v150,96 154,100 57-64.1
  Bottom 0.762: v150,96 150,79 151.5,79 JP39.2
LED65  (via drill 0.39)
  Top 0.762: 65-72.8 168,121 v163,116 160.78,116 160.6,115.82 159.82,115.82 v159,115
  Bottom 0.762: JP39.4 154,78.5 152.5,77 149,77 149,105 v159,115
LED66  (via drill 0.39)
  Top 0.762: v160,88 160,82 157,79 JP39.6
  Bottom 0.762: v160,88 170.5,98.5 170.5,121 65-72.7
LED67
  Bottom 0.762: JP40.2 161.5,79 160,80.5 160,85.5 173,98.5 173,121 65-72.6
LED68
  Bottom 0.762: 164,106.5 163.75,106.25 | 163.75,106.25 159,101.5 159,77 162.5,77 164,78.5 JP40.4 | 65-72.5 175.5,121 175.5,123 165.5,123 164,121.5 164,113 164.5,113 169,108.5 169,106 164,106 163.75,106.25
LED69
  Bottom 0.762: JP40.6 167,79 169,81 169,92 178,101 178,121 65-72.4
LED70
  Bottom 0.762: JP41.2 171.5,79 170,80.5 170,84.5 180.5,95 180.5,121 65-72.3
LED71
  Bottom 0.762: JP41.4 174.5,78.5 176,77 180.5,77 180.5,81 188,88.5 188,121.5 186.5,123 183.5,123 183.5,121 65-72.2
LED72
  Bottom 0.762: 65-72.1 186,88 177,79 JP41.6
LED73  (via drill 0.39)
  Top 0.762: v229,60.5 226,60.5 225.5,61 JP42.2
  Bottom 0.762: v229,60.5 231.5,58 231.5,53 232.5,52 233,52 233,25 232,24 232,21 73-80.8 231.5,21
LED74  (via drill 0.39)
  Top 0.762: v228,64.5 v226,64.5
  Bottom 0.762: v226,64.5 223,61.5 JP42.4 | 228.25,21.75 229,21 73-80.7 | 228.25,21.75 228,22 | 228.25,21.75 232,25.5 232,51 228,55 v228,64.5
LED75
  Bottom 0.762: JP42.6 220.5,61.5 224.5,65.5 227,65.5 227,57.5 226.5,57 226,57 226,35.5 226.5,35 226.5,21 73-80.6 227,21
LED76  (via drill 0.39)
  Top 0.762: v220.5,56 215.5,61 JP43.2
  Bottom 0.762: v220.5,56 224.5,52 224.5,21 73-80.5
LED77
  Bottom 0.762: JP43.4 213,61.5 214.5,63 218.5,63 218.5,24 221.5,21 73-80.4
LED78
  Bottom 0.762: JP43.6 210,61 208.5,59.5 208.5,31.5 219,21 73-80.3
LED79
  Bottom 0.762: JP44.2 205.5,61 207.5,59 207.5,30 216.5,21 73-80.2
LED80
  Bottom 0.762: 73-80.1 198.5,36.5 198.5,63 201,63 202.5,61.5 JP44.4
LED81
  Top 0.762: JP44.6 200,61 198.5,59.5 198.5,55 241.5,55 245,58.5 81-88.8
LED82  (via drill 0.39)
  Top 0.762: v196.5,52 241,52 245,56 81-88.7
  Bottom 0.762: v196.5,52 196.5,61 195,61 JP45.2
LED83
  Top 0.762: JP45.4 192.5,61.5 194,63 195.5,63 196.5,62 196.5,53 196,53 195.5,52.5 195.5,51 242.5,51 245,53.5 81-88.6
LED84
  Top 0.762: JP45.6 189.5,61 188,59.5 188,50 244,50 245,51 81-88.5
LED85  (via drill 0.39)
  Top 0.762: v194,49 245,49 81-88.4
  Bottom 0.762: v194,49 187,56 187,76 189.5,78.5 JP48.2
LED86  (via drill 0.39)
  Top 0.762: v196.5,48 197.5,47 244.5,47 245,46.5 81-88.3
  Bottom 0.762: v196.5,48 188,56.5 188,74.5 192,78.5 JP48.4
LED87
  Top 0.762: JP48.6 195,79 202,86 236.5,86 244.5,78 250.5,78 251.5,77 251.5,44 245,44 81-88.2
LED88
  Bottom 0.762: 81-88.1 238.5,41 236,43.5 236,55 229,62 229,66.5 212.5,66.5 200.5,78.5 JP49.2
LED89  (via drill 0.39)
  Top 0.762: v207.5,115.5 210,118 216,118 218,120 89-96.8
  Bottom 0.762: v207.5,115.5 207.5,77 204.5,77 203,78.5 JP49.4
LED90  (via drill 0.39)
  Top 0.762: v215.5,85 208.5,85 208.5,82 205.5,79 JP49.6
  Bottom 0.762: v215.5,85 220.5,90 220.5,120 89-96.7
LED91  (via drill 0.39)
  Top 0.762: v213,115 215,117 220,117 223,120 89-96.6
  Bottom 0.762: v213,115 208.5,110.5 208.5,80.5 210,79 JP50.2
LED92  (via drill 0.39)
  Top 0.762: v217,85 217,78.5 215.5,77 214.5,77 213,78.5 JP50.4
  Bottom 0.762: v217,85 225.5,93.5 225.5,120 89-96.5
LED93
  Bottom 0.762: JP50.6 215.5,79 217,80.5 217,82 214,85 214,120.5 215.5,122 228,122 228,120 89-96.4
LED94
  Bottom 0.762: JP51.2 220,79 218.5,80.5 218.5,85 230.5,97 232,97 232,108.5 231,109.5 231,120 89-96.3 230.5,120
LED95
  Bottom 0.762: JP51.4 223,78.5 224.5,77 229,77 229,81 237.5,89.5 237.5,119 238,119.5 238,120.5 236.5,122 233.5,122 233.5,120 89-96.2
LED96
  Bottom 0.762: 89-96.1 236,89.5 225.5,79 JP51.6
LED+  (via drill 0.39)
  Top 0.762: 6.5,37 6.35,37.03 | 223,115 223,115.09 | 4,37 3.68,37.16 | 228.5,115 228.5,115.09 | 253,130 252.86,130 | JP8.5 65,86.69 v65,88 | 17-24.9 59,120 v50,111 | v84,86 88.57,81.43 JP28.1 | JP45.5 189,57.67 v189,51 | JP51.5 228.89,78 v242,78 | v243,82 245,80 57-64.9 | v234,16 234,20.68 73-80.9 | 33-40.9 241.98,107.7 241.98,108.41 238.88,111.52 v228,111.52 | JP2.1 83.73,55.26 v90.48,55.26 | JP25.1 98,58.37 98,55 v100,53 101,53 103.28,55.28 JP24.5 | JP23.1 118.52,48.52 v118,48 | v118,45 127,45 v127.45,45.45 | JP28.5 98.2,100.07 101.1,102.97 105.97,102.97 v106,103 v116,103 v128,103 | v143,88 141,90 v141,91 | JP6.3 58,92.03 v58,107 | v65,110 v80,110 87,110 | 87,110 v88,110 | 87,110 v94,117 | JP5.1 48,56.63 v48,43 | v48,39 v67,39 | JP45.1 194.98,56.02 v195,56 | JP44.1 205.14,56.14 v205,56 | v205,53 v233,53 | 199,80 199,80.37 JP49.1 199.6,81.43 | 188.42,79.5 189.29,80.36 193.91,80.36 JP48.5 | 188.42,79.5 188.42,78.28 189.29,77.42 195.59,77.42 199.6,81.43 | JP50.1 209.76,81.43 205.75,77.42 199.45,77.42 198.58,78.28 198.58,79.5 199.6,80.52 199.6,81.43 | v211,94 v230,94 | v177,39 v204,39 | v102,29 v88,29 | D1.A 38.73,29.27 v39,29 | 188.42,79.5 188,79.92 v188,81 | v185,83 191,89 191,89.14 191.43,89.57 v191.5,89.5 | JP41.5 186.51,91 v190,91 | JP31.5 134.57,81.43 v137,79
  Bottom 0.762: v65,88 v65,110 65,115.32 17-24.9 | v50,111 50,81.49 JP6.5 | JP9.5 83.99,85 84,85 v84,86 84,101 88,105 v88,110 | JP32.1 v176.94,50 176.94,39.06 v177,39 v177,34 v177,29 | v189,51 187,51 v185,49 | 81-88.9 57-64.9 | v242,78 242,81 v243,82 | 9-16.9 244.68,16 v234,16 | v228,111.52 v228,115 | v90.48,55.26 94.26,55.26 v95,56 | v118,48 v118,45 | v127.45,45.45 126.14,46.75 JP22.3 | JP35.3 143.92,45.08 v144,45 v144,34 v144,29.52 | JP34.3 154.08,45.08 v154,45 | v106,103 v106,99 | v116,103 v116,99 | v128,103 v128,99 | JP38.3 143.92,87.08 v143,88 | v141,91 140,92 v140,94 | v58,107 v58,111 | v80,110 79,109 v79,107 | v94,117 v96,119 | v48,43 v48,39 | v67,39 v67,43 | v205,56 v205,53 205,40 v204,39 | v233,53 232.48,53.52 v232.48,56 | JP50.1 210.22,93.22 v211,94 | v230,94 225.46,89.46 JP51.5 | D2.A 101.73,29.27 v102,29 | v88,29 90.32,26.68 1-8.9 | v98.55,111.45 98.55,111.18 98.75,110.98 98.91,110.98 99.48,110.41 99.48,110.25 D6.A | v160.2,116.8 160.2,114.2 163.98,110.41 163.98,108.75 D7.A | v39,29 39,26 | 39,26 v39,25 | 39,26 31,26 v30,25 | v188,81 187,81 v185,83 | v191.5,89.5 v190,91 | v137,79 138.95,79 JP38.1
  other vias: 128.68,81.43
  pour Top: 0.95,139.05 252.86,139.05 252.86,0.95 0.95,0.95
N$1  (via drill 0.39)
  Bottom 0.762: U$1.RAW 10.5,86.5 8.5,84.5 8.5,43.5 JP11.1 9,43 9,39.5 10,38.5 S1.1 16.14,38.1 SJ2.1
  other vias: 18.24,36
N$4
  Top 0.762: J9.1 225,103 245.5,103 248,105.5 248,110 NEOPASSTHROUGH.1
N$30
  Top 0.762: J3.4 95.5,40.5 41,40.5 37,36.5 37,36 J2.1
N$31  (via drill 0.39)
  Top 0.762: J4.4 v103,39
  Bottom 0.762: J3.1 100,36 100,39 v103,39
N$32  (via drill 0.39)
  Top 0.762: J4.1 161.5,34.5 161.5,38.5 162,39 176,39 176,38.5 176.5,38 222,38 J5.4
  Bottom 0.762: J5.4 v220,36
N$34  (via drill 0.39)
  Top 0.762: v42,39.5 50,31.5 221.5,31.5 J5.1
  Bottom 0.762: v42,39.5 42,103 37,103 37,108 J6.4
N$35
  Top 0.762: J6.1 32.5,106.5 32.5,117 37.5,122 90.5,122 97,115.5 J7.4
N$36  (via drill 0.39)
  Top 0.762: 100,108 99.75,107.75 | 99.75,107.75 J7.1 | 99.75,107.75 101.5,106 157,106 v157,108
  Bottom 0.762: J8.4 v157,108
N$37  (via drill 0.39)
  Top 0.762: v163,110 164,111 J9.4
  Bottom 0.762: J8.1 163,108 v163,110
NEODATA1
  Bottom 0.762: U$1.D8 26.5,61 28,59.5 28,49 26,47 R1.1
VCC  (via drill 0.39)
  Top 0.762: JP12.1 250,64 231,64 JP46.1 230.5,63.5 196.5,63.5 196,64 185,64 JP47.1 184.5,64 182.5,64 JP36.1 182,64 136.5,64 JP37.1 136,64 134,64 JP26.1 133.5,64 88.5,64 JP27.1 88,64 86,64 JP1.1 85.5,64 83,66.5 42.5,66.5 40,64 JP10.1 39.5,64 36,64 JP13.1 | J9.3 222,110 164.5,110 163.5,109 J8.3 105.5,109 104.5,110 101,110 100,109 J7.3 42.5,109 41.5,110 35,110 J6.3 | J4.3 106,37 106,35.5 104.5,34 98.5,34 98.5,35.5 J3.3 | J5.3 168.5,37 167.5,38 v162.5,38
  Bottom 0.762: NEOPASSTHROUGH.2 250,107 248,107 248,66 250,64 JP12.1 | J3.3 88.5,45.5 88.5,63.5 JP27.1 | 24,81 24,99 J6.3 | 24,81 24,78 | 24,78 27.5,78 28,77.5 28,72 36,64 JP13.1 36,39 J2.3 20.76,37 SJ2.2 | SJ1.1 22,79 | 22,79 23,79 24,78 | 22,79 24,81 | v162.5,38 161.5,37 J4.3
  other vias: 15.76,79 19.76,36
VCCNANO
  Top 0.762: U$1.5V 13.97,79.27 SJ1.2

### Text on the board
tNames: + | + | + | + | + | + | + | + | + | + | + | + | + | + | + | Designed By David Bershasky